# EAGLE design EBN_KL27Z4_V05 (EAGLE 7.3.0)
CNAME: EasyBoard Nano; CREVISION: 2.0; DESIGNER: Martin Olejar
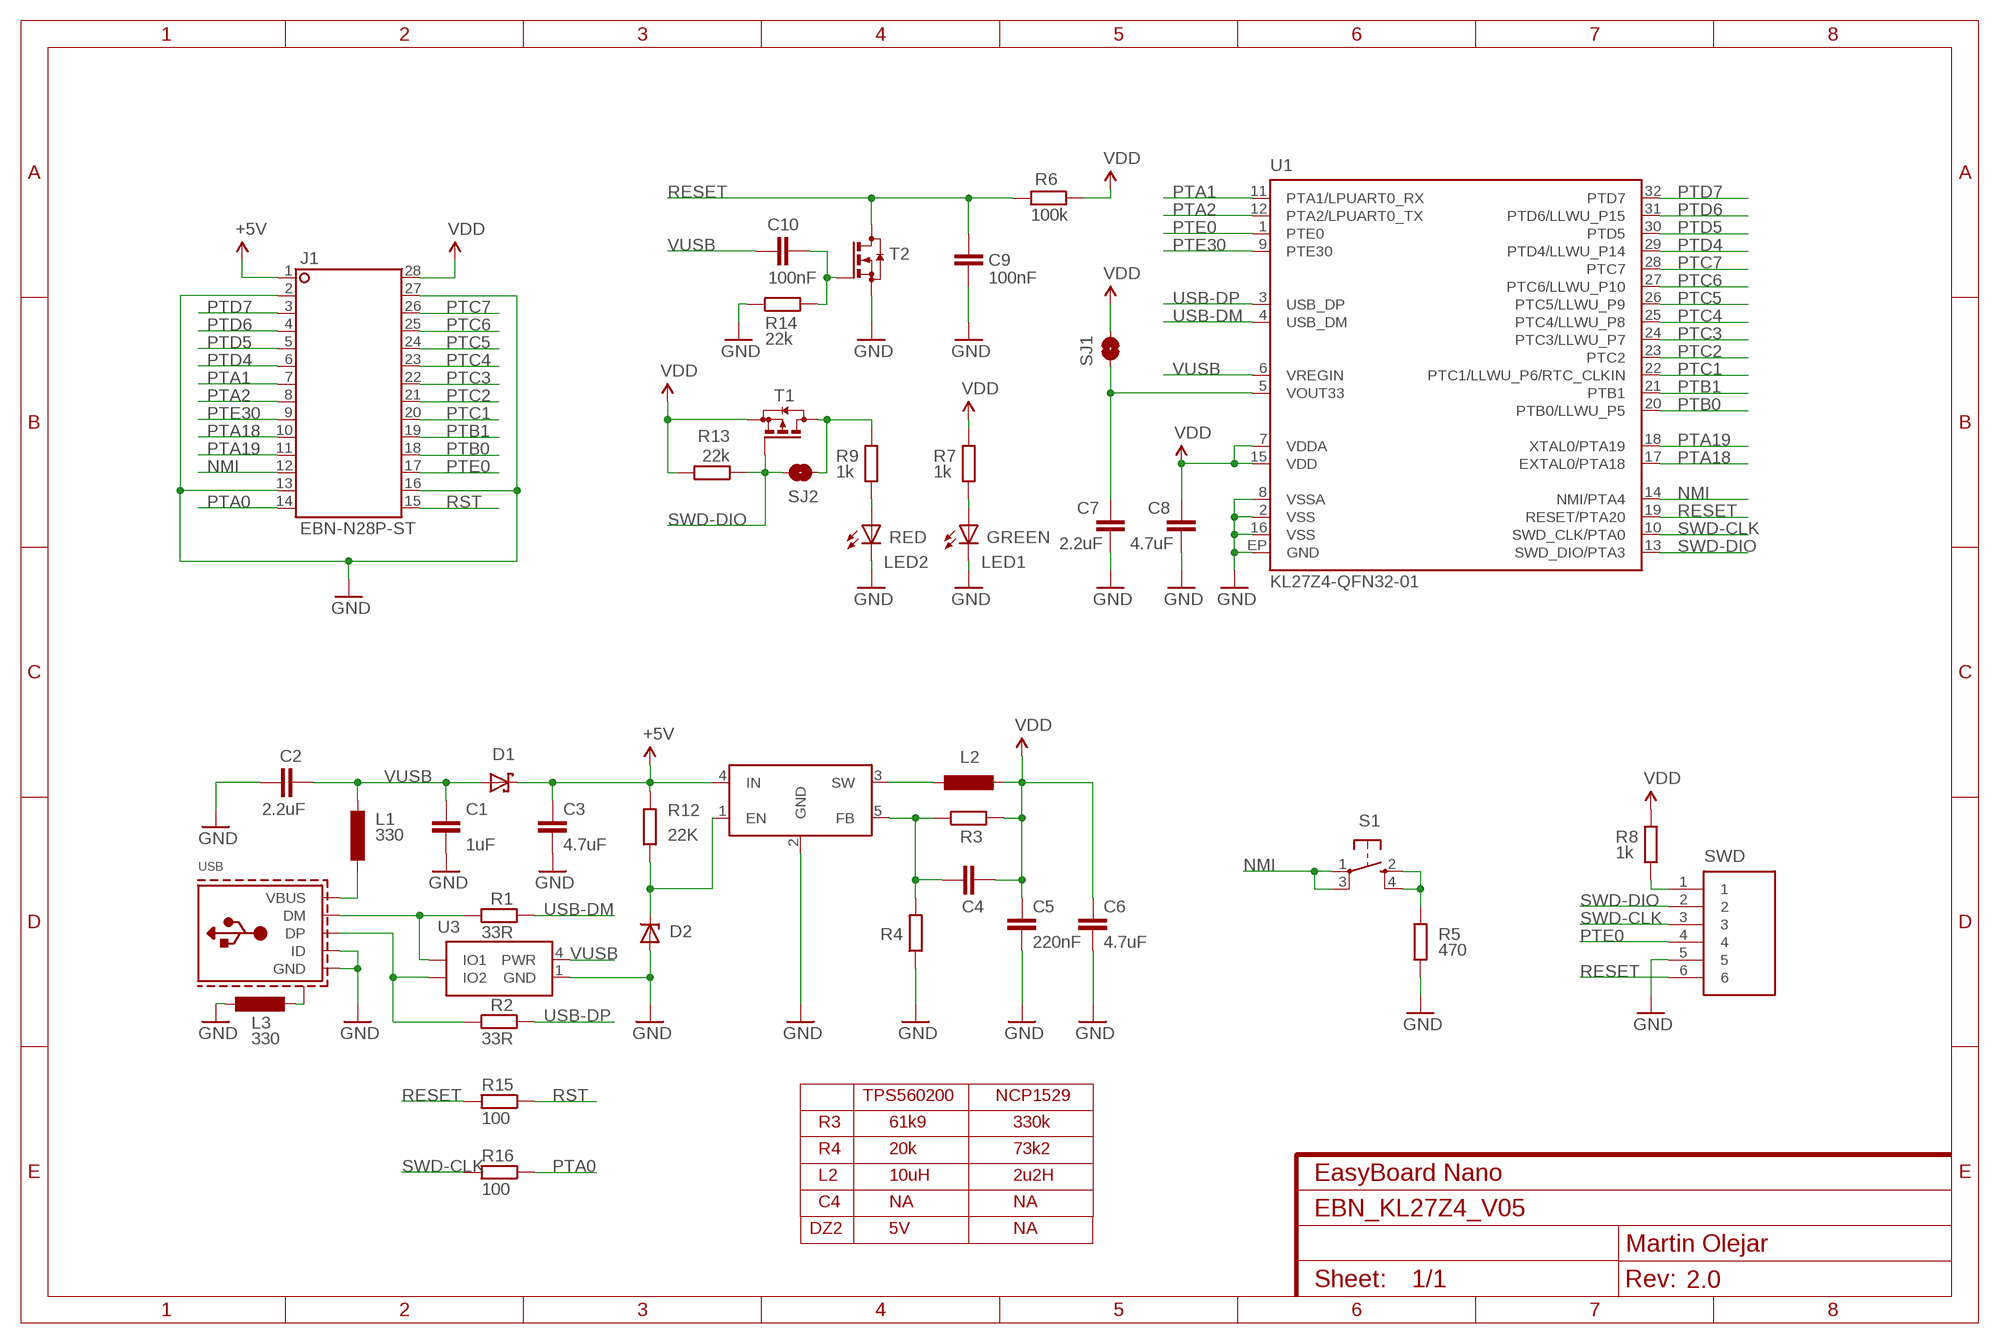
[diagram p0: schematic, sheet 1]

## Parts
C1  1uF  C-EUC0402  [C0402]
C2  2.2uF  C-EUC0603  [C0603]
C3  4.7uF  C-EUC0603  [C0603]
C4  *  C-EUC0402  [C0402]
C5  220nF  C-EUC0603  [C0603]
C6  4.7uF  C-EUC0603  [C0603]
C7  2.2uF  C-EUC0603  [C0603]
C8  4.7uF  C-EUC0603  [C0603]
C9  100nF  C-EUC0402  [C0402]
C10  100nF  C-EUC0402  [C0402]
D1  PMEG2010BER_SHOTTKY-SOD123FL  [SOD-123FL]
D2  DZ  [SOD323_ST]
J1  EBN-N28P-ST  [EBN-N28P-SHIELD]
L1  330  L-EUL0805  [L0805]
L2  2u2  L-EULPS3015  [LPS3015]
L3  330  L-EUL0805  [L0805]
LED1  LEDCHIPLED_0603  [CHIPLED_0603]
LED2  LEDCHIPLED_0603  [CHIPLED_0603]
R1  33R  R-EUR0402  [R0402]
R2  33R  R-EUR0402  [R0402]
R3  *  R-EUR0402  [R0402]
R4  *  R-EUR0402  [R0402]
R5  470  R-EUR0402  [R0402]
R6  100k  R-EUR0402  [R0402]
R7  1k  R-EUR0402  [R0402]
R8  1k  R-EUR0402  [R0402]
R9  1k  R-EUR0402  [R0402]
R12  22K  R-EUR0603  [R0603]
R13  22k  R-EUR0402  [R0402]
R14  22k  R-EUR0402  [R0402]
R15  100  R-EUR0402  [R0402]
R16  100  R-EUR0402  [R0402]
S1  SWITCH-TACT2  [KMR2]
SJ1  SJ-S  [JUMPER-SMD-S1X]
SJ2  SJ-S  [JUMPER-SMD-S1X]
SWD  CON-1X6JST-SIDE  [CON-JST1X6-SIDE]
T1  -PMOS-SOT323  [SOT323]
T2  -NMOS-SOT323  [SOT323]
U1  KL27Z4-QFN32-01  [QFN-32]
U2  MP215P  [SOT23-5L]
U3  PRTR5V0U2X  [SOT-143B]
USB  USB-5P-MICRO-SMD-05  [USB-MICRO-SMD-05]

## Nets
+5V: C3.1 D1.C J1.1 R12.2 U2.4(IN)
DM: R1.1 U3.3(IO1) USB.DM
DP: R2.1 U3.2(IO2) USB.DP
GND: C1.1 C2.2 C3.2 C5.2 C6.2 C7.2 C8.2 C9.2 D2.A J1.2 J1.13 J1.16 J1.27 L3.2 LED1.C LED2.C R4.1 R5.1 R14.1 SWD.5 T2.2(S) U1.2(VSS) U1.8(VSSA) U1.16(VSS) U1.EP(GND) U2.2(GND) U3.1(GND) USB.GND USB.ID
N$1: L1.1 USB.VBUS
N$2: L3.1 USB.SHILD@1(SHILD) USB.SHILD@2(SHILD) USB.SHILD@3(SHILD) USB.SHILD@4(SHILD)
N$3: LED1.A R7.1
N$4: D2.C R12.1 U2.1(EN)
N$5: R5.2 S1.2 S1.4
N$6: C7.1 SJ1.1 U1.5(VOUT33)
N$8: R8.1 SWD.1
N$9: LED2.A R9.1
N$10: R9.2 SJ2.1 T1.3(D)
N$12: C10.2 R14.2 T2.1(G)
N$21: L2.P$1 U2.3(SW)
N$22: C4.1 R3.1 R4.2 U2.5(FB)
NMI: J1.12 S1.1 S1.3 U1.14(NMI/PTA4)
PTA0: J1.14 R16.1
PTA1: J1.7 U1.11(PTA1/LPUART0_RX)
PTA2: J1.8 U1.12(PTA2/LPUART0_TX)
PTA18: J1.10 U1.17(EXTAL0/PTA18)
PTA19: J1.11 U1.18(XTAL0/PTA19)
PTB0: J1.18 U1.20(PTB0/LLWU_P5)
PTB1: J1.19 U1.21(PTB1)
PTC1: J1.20 U1.22(PTC1/LLWU_P6/RTC_CLKIN)
PTC2: J1.21 U1.23(PTC2)
PTC3: J1.22 U1.24(PTC3/LLWU_P7)
PTC4: J1.23 U1.25(PTC4/LLWU_P8)
PTC5: J1.24 U1.26(PTC5/LLWU_P9)
PTC6: J1.25 U1.27(PTC6/LLWU_P10)
PTC7: J1.26 U1.28(PTC7)
PTD4: J1.6 U1.29(PTD4/LLWU_P14)
PTD5: J1.5 U1.30(PTD5)
PTD6: J1.4 U1.31(PTD6/LLWU_P15)
PTD7: J1.3 U1.32(PTD7)
PTE0: J1.17 SWD.4 U1.1(PTE0)
PTE30: J1.9 U1.9(PTE30)
RESET: C9.1 R6.2 R15.2 SWD.6 T2.3(D) U1.19(RESET/PTA20)
RST: J1.15 R15.1
SWD-CLK: R16.2 SWD.3 U1.10(SWD_CLK/PTA0)
SWD-DIO: R13.1 SJ2.2 SWD.2 T1.1(G) U1.13(SWD_DIO/PTA3)
USB-DM: R1.2 U1.4(USB_DM)
USB-DP: R2.2 U1.3(USB_DP)
VDD: C4.2 C5.1 C6.1 C8.1 J1.28 L2.P$2 R3.2 R6.1 R7.2 R8.2 R13.2 SJ1.2 T1.2(S) U1.7(VDDA) U1.15(VDD)
VUSB: C1.2 C2.1 C10.1 D1.A L1.2 U1.6(VREGIN) U3.4(PWR)

## Notes on the sheet
- RED | GREEN
- TPS560200 | NCP1529
- R3 | 61k9 | 330k
- R4 | 20k | 73k2
- L2 | 10uH | 2u2H
- C4 | NA | NA
- DZ2 | 5V | NA

## Library data of the parts
C1-C10 = atomx_RLC:C-EU: CAPACITOR, European symbol
D1 = atomx_DiscreteSemi:*_SHOTTKY-
D2 = atomx_DiscreteSemi:DZ
J1 = atomx_Boards:EBN-N28P: Dual In Line
L1-L3 = atomx_RLC:L-EU: INDUCTOR, European symbol
LED1 LED2 = led:LED: LED OSRAM: - CHIPLED LG R971, LG N971, LY N971, LG Q971, LY Q971, LO R971, LY R971 LH N974, LH R974 LS Q976, LO Q976, LY Q976 LO Q996 - Hyper CHIPLED LW Q18S LB Q993, LB Q99A, LB R99A - SideLED LS A670, LO A670, LY A670, LG A670, LP A670 LB A673, LV A673, LT A673, LW A673 LH A674 LY A675 LS A676, LA A676, LO A676, LY A676, LW A676 LS A679, LY A679, LG A679 - Hyper Micro SIDELED® LS Y876, LA Y876, LO Y876, LY Y876 LT Y87S - SmartLED LW L88C, LW L88S LB L89C, LB L89S, LG L890 LS L89K, LO L89K, LY L89K LS L896, LA L896, LO L896, LY L896 - TOPLED LS T670, LO T670, LY T670, LG T670, LP T670 LSG T670, LSP T670, LSY T670, LOP T670, LYG T670 LG T671, LOG T671, LSG T671 LB T673, LV T673, LT T673, LW T673 LH T674 LS T676, LA T676, LO T676, LY T676, LB T676, LH T676, LSB T676, LW T676 LB T67C, LV T67C, LT T67C, LS T67K, LO T67K, LY T67K, LW E67C LS E67B, LA E67B, LO E67B, LY E67B, LB E67C, LV E67C, LT E67C LW T67C LS T679, LY T679, LG T679 LS T770, LO T770, LY T770, LG T770, LP T770 LB T773, LV T773, LT T773, LW T773 LH T774 LS E675, LA E675, LY E675, LS T675 LS T776, LA T776, LO T776, LY T776, LB T776 LHGB T686 LT T68C, LB T68C - Hyper Mini TOPLED® LB M676 - Mini TOPLED Santana® LG M470 LS M47K, LO M47K, LY M47K Source: http://www.osram.convergy.de LUXEON: - LUMILED® LXK2-PW12-R00, LXK2-PW12-S00, LXK2-PW14-U00, LXK2-PW14-V00 LXK2-PM12-R00, LXK2-PM12-S00, LXK2-PM14-U00 LXK2-PE12-Q00, LXK2-PE12-R00, LXK2-PE12-S00, LXK2-PE14-T00, LXK2-PE14-U00 LXK2-PB12-K00, LXK2-PB12-L00, LXK2-PB12-M00, LXK2-PB14-N00, LXK2-PB14-P00, LXK2-PB14-Q00 LXK2-PR12-L00, LXK2-PR12-M00, LXK2-PR14-Q00, LXK2-PR14-R00 LXK2-PD12-Q00, LXK2-PD12-R00, LXK2-PD12-S00 LXK2-PH12-R00, LXK2-PH12-S00 LXK2-PL12-P00, LXK2-PL12-Q00, LXK2-PL12-R00 Source: www.luxeon.com KINGBRIGHT: KA-3528ASYC Source: www.kingbright.com
R1-R9 R12-R16 = atomx_RLC:R-EU: RESISTOR, European symbol
S1 = atomx_ElecMech:SWITCH-TACT2
SJ1 SJ2 = atomx_Connectors:SJ: SMD solder JUMPER
SWD = atomx_Connectors:CON-1X6
T1 = atomx_DiscreteSemi:*-PMOS-
T2 = atomx_DiscreteSemi:*-NMOS-
U1 = atomx_IC:KL27Z4-QFN32: Freescale Kinetis-L MCU: KL27Z (Cortex-M0)
U2 = atomx_Power:MP21*5P
U3 = atomx_DiscreteSemi:PRTR5V0U2X?; APPLICATIONS: General Purpose; BIDIRECTIONAL_CHANNELS: 2; CAPACITANCE: 1pF @ 1MHz; CURRENT_PEAK_PULSE: -; DESCRIPTION: TVS DIODE 5.5VWM SOT143B; DOCUMENTATION_LINK: <a href="http://www.nxp.com/documents/data_sheet/PRTR5V0U2X.pdf">Datasheet</a>; DOCUMENTATION_URL: http://www.nxp.com/documents/data_sheet/PRTR5V0U2X.pdf; MANUFACTURER: NXP Semiconductors; MOUNTING_TYPE: Surface Mount; OPERATING_TEMPERATURE: -40C ~ 85C; PART_NUMBER: PRTR5V0U2X,215; POWER-PEAK_PULSE: -; POWER_LINE_PROTECTION: Yes; SUPPLIER_ITEM_LINK: <a href="http://www.digikey.com/product-detail/en/PRTR5V0U2X,215/568-4140-1-ND/1589981">Details</a>; SUPPLIER_ITEM_NUMBER: 568-4140-1-ND; SUPPLIER_ITEM_URL: http://www.digikey.com/product-detail/en/PRTR5V0U2X,215/568-4140-1-ND/1589981; SUPPLIER_LINK: <a href="http://www.digikey.com">Home Page</a>; SUPPLIER_NAME: Digi-Key; SUPPLIER_URL: http://www.digikey.com; TYPE: Steering (Rail to Rail); UNIDIRECTIONAL_CHANNELS: -; VOLTAGE_BREAKDOWN: 6V; VOLTAGE_CLAMPING: -; VOLTAGE_REVERSE: 5.5V
USB = atomx_Connectors:USB-5P: USB Connectors

## Board
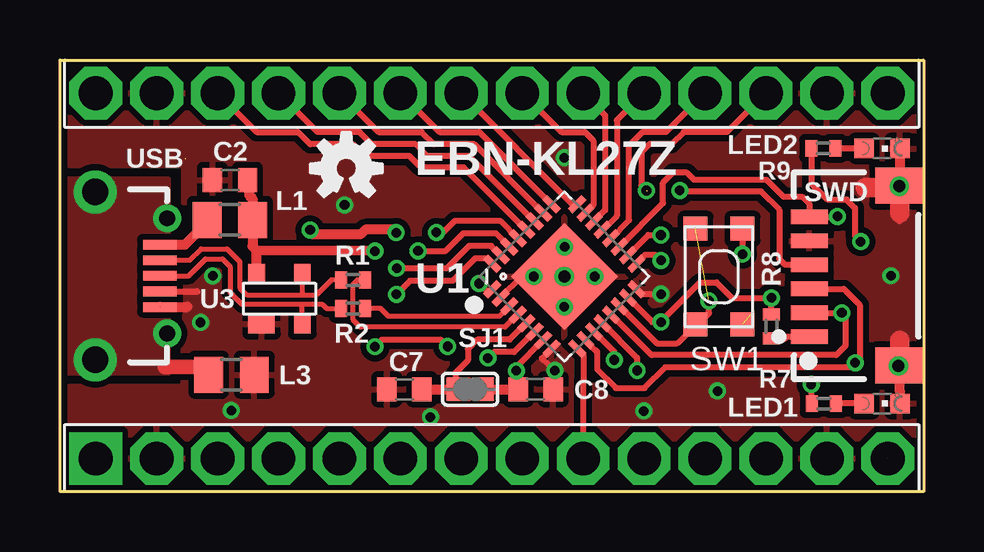
[diagram p1: board, top side]
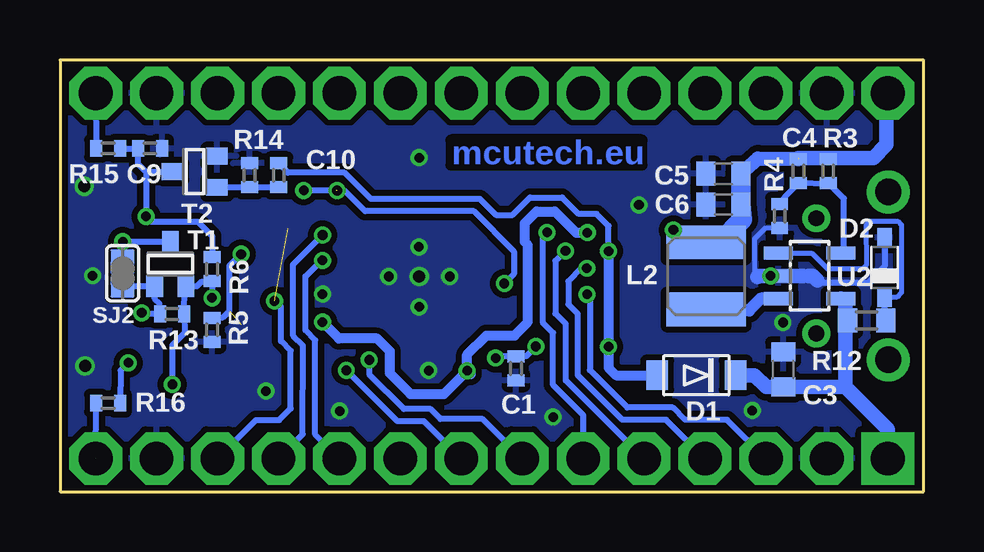
[diagram p2: board, bottom side, seen from below]

Size 36 x 18 mm. Coordinates in mm from the lower left corner, seen from the top.
Outline: 0,0 0,18 36,18 36,0 0,0
Copper layers (1*16): Top 0.035mm / dielectric 1.5mm / Bottom 0.035mm
Design rules "ITEADstudio_DRC *": minimum track width 6mil, minimum drill 12mil, track to track 10mil, track to pad 10mil, pad to pad 10mil, via to via 10mil, smd to smd 10mil, copper to edge 10mil, drill to drill 10mil, minimum pad ring 10mil, minimum via ring 6mil, stop-mask expansion 2mil, vias tented up to drill 100mil, thermal gap 10mil

### Footprints (pad centres in the part's own frame; a part is rotated, then mirrored left to right if it is on the bottom)
C0402 = smd 0.5 x 0.7: 1 -0.5,0; 2 0.5,0
C0603 = smd 0.8 x 1: 1 -0.73,0; 2 0.73,0
SOD-123FL = smd 0.91 x 1.22: A 1.637,0; C -1.637,0
SOD323_ST = smd 0.8 x 0.6: A 1.25,0; C -1.25,0
EBN-N28P-SHIELD = drill 1.4 pad 2.2 square: 1 -16.51,-7.62 | drill 1.4 pad 2.2 octagon: 2 -13.97,-7.62; 3 -11.43,-7.62; 4 -8.89,-7.62; 5 -6.35,-7.62; 6 -3.81,-7.62; 7 -1.27,-7.62; 8 1.27,-7.62; 9 3.81,-7.62; 10 6.35,-7.62; 11 8.89,-7.62; 12 11.43,-7.62; 13 13.97,-7.62; 14 16.51,-7.62; 15 16.51,7.62; 16 13.97,7.62; 17 11.43,7.62; 18 8.89,7.62; 19 6.35,7.62; 20 3.81,7.62; 21 1.27,7.62; 22 -1.27,7.62; 23 -3.81,7.62; 24 -6.35,7.62; 25 -8.89,7.62; 26 -11.43,7.62; 27 -13.97,7.62; 28 -16.51,7.62
L0805 = smd 1.2 x 1.5: 1 -0.95,0; 2 0.95,0
LPS3015 = smd 1.4 x 3.3: P$1 -1.4,0; P$2 1.4,0
CHIPLED_0603 = smd 0.8 x 0.8: A 0,-0.75; C 0,0.75
R0402 = smd 0.5 x 0.7: 1 -0.5,0; 2 0.5,0
R0603 = smd 0.8 x 1: 1 -0.8,0; 2 0.8,0
KMR2 = smd 1 x 1: 1 2,0.98; 2 2,-0.98; 3 -2,0.98; 4 -2,-0.98
JUMPER-SMD-S1X = smd 0.6 x 1: 1 -0.7,0; 2 0.7,0
CON-JST1X6-SIDE = smd 0.6 x 1.55: 1 -2.54,2.032; 2 -1.54,2.032; 3 -0.54,2.032; 4 0.46,2.032; 5 1.46,2.032; 6 2.46,2.032 | smd 1.5 x 2: P$1 -3.74,-1.72; P$2 3.76,-1.72
SOT323 = smd 0.7 x 0.9: 1 -0.65,-0.925; 2 0.65,-0.925; 3 0,0.925
QFN-32 = smd 0.8 x 0.285: 1 -2.5,1.75; 2 -2.5,1.25; 3 -2.5,0.75; 4 -2.5,0.25; 5 -2.5,-0.25; 6 -2.5,-0.75; 7 -2.5,-1.25; 8 -2.5,-1.75; 17 2.5,-1.75; 18 2.5,-1.25; 19 2.5,-0.75; 20 2.5,-0.25; 21 2.5,0.25; 22 2.5,0.75; 23 2.5,1.25; 24 2.5,1.75 | smd 0.285 x 0.8: 9 -1.75,-2.5; 10 -1.25,-2.5; 11 -0.75,-2.5; 12 -0.25,-2.5; 13 0.25,-2.5; 14 0.75,-2.5; 15 1.25,-2.5; 16 1.75,-2.5; 25 1.75,2.5; 26 1.25,2.5; 27 0.75,2.5; 28 0.25,2.5; 29 -0.25,2.5; 30 -0.75,2.5; 31 -1.25,2.5; 32 -1.75,2.5 | smd 3.15 x 3.15: EP 0,0
SOT23-5L = smd 0.55 x 1.2: 1 -0.95,-1.3; 2 0,-1.3; 3 0.95,-1.3; 4 0.95,1.3; 5 -0.95,1.3
SOT-143B = smd 1.1 x 0.8: 1 -0.75,-1.05 | smd 0.7 x 0.8: 2 0.95,-1.05; 3 0.95,1.05; 4 -0.95,1.05
USB-MICRO-SMD-05 = smd 1.4 x 0.4: DM 2.7,0.65; DP 2.7,0; GND 2.7,-1.3; ID 2.7,-0.65; VBUS 2.7,1.3 | drill 1.1 pad 1.8: SHILD@1 0,-3.5; SHILD@2 0,3.5 | drill 0.65 pad 1.1: SHILD@3 3,-2.4; SHILD@4 3,2.4

### Placement (x,y rotation side)
C1  16.99,5.14 90 bottom
C2  7.09,12.99 180 top
C3  5.84,5.1 90 bottom
C4  5.22,13.36 90 bottom
C5  8.35,11.98 180 bottom
C6  8.35,13.25 180 bottom
C7  14.36,4.27 180 top
C8  19.83,4.27 0 top
C9  32.25,14.31 0 bottom
C10  26.88,13.19 270 bottom
D1  9.47,4.85 180 bottom
D2  1.62,9.35 90 bottom
J1  18,9 0 top
L1  7.09,11.33 0 top
L2  9.06,8.99 90 bottom
L3  7.15,4.87 0 top
LED1  34.27,3.67 270 top
LED2  34.27,14.31 270 top
R1  12.22,8.82 0 top
R2  12.21,7.64 0 top
R3  3.97,13.37 90 bottom
R4  6,11.49 90 bottom
R5  29.66,6.75 90 bottom
R6  29.66,9.27 90 bottom
R7  31.84,3.67 180 top
R8  29.66,6.89 90 top
R9  31.82,14.31 180 top
R12  2.37,7.13 180 bottom
R13  31.33,7.41 0 bottom
R14  28.09,13.19 270 bottom
R15  33.99,14.31 0 bottom
R16  33.99,3.69 0 bottom
S1  27.47,8.96 90 top
SJ1  17.1,4.27 0 top
SJ2  33.39,9.1 270 bottom
SWD  33.27,9 90 top
T1  31.4,9.49 0 bottom
T2  30.38,13.34 90 bottom
U1  21.02,8.97 45 top
U2  4.75,9 270 bottom
U3  9.15,8.04 0 top
U$2  [OSHW-LOGO-S]  11.93,13.48 0 top
USB  1.47,9 0 top

### Tracks (layer width: path | path; a pad name or v marks a point on that pad's centre or on a via)
+5V
  Bottom 0.254: R12.2 3.21,6.9 3.26,6.95
  Bottom 0.61: 5.77,4.36 C3.1 | U2.4 3.26,8 3.26,6.95 3.26,4.37 | C3.1 3.26,4.37 | D1.C 7.05,4.85 6.56,4.36 5.86,4.36 C3.1 | J1.1 1.49,2.6 3.26,4.37
DM
  Top 0.2: 4.33,9.66 5.42,9.66 5.88,10.12 6.96,10.12 7.49,9.59 7.49,8.5 7.79,8.2 10.1,8.2 | R1.1 11.31,8.82 10.69,8.2 10.1,8.2 | U3.3 10.1,8.2
  Top 0.254: USB.DM 4.33,9.66
DP
  Top 0.2: USB.DP 5.37,9 6.07,9.7 6.78,9.7 7.09,9.39 7.09,8.31 7.6,7.8 10.09,7.8 | 10.13,6.96 U3.2 10.1,7.79 10.09,7.8 | 10.09,7.8 10.95,7.8 11.12,7.63 11.69,7.63 R2.1
GND  (via drill 0.4, 0.5)  (1 unrouted)
  Top 0.254: U1.2 19.26,8.97 19.5,8.97 | 20.52,5.99 U1.8 20.08,5.56 v20.63,5.05 20.54,4.4 20.71,4.18 | 35.01,11.62 35.01,11.26 34.89,12.68 | 34.89,5.31 34.89,5.06 35.01,6.31 | 23.83,8.63 24.23,8.23 v25.05,8.23 | 5.72,8.35 5.72,8.34 4.32,8.34 USB.ID | LED1.C 35.02,4.17 | v34.99,12.73 35.04,12.78
  Top 0.406: 19.5,8.97 v19.75,8.97 | USB.GND 5.32,7.7 | 35.02,4.17 35.02,4.95 | 35.04,12.78 35.04,14.32
  Top 0.61: 35.02,5.18 35.01,6.31
  Top 0.813: 35.01,13.1 35.01,11.62 | 35.01,6.31 35.02,4.95 | 33.58,12.68 34.89,12.68
  Bottom 0.2: 7.05,8.94 7.05,10.54 6.62,10.97 R4.1
  Bottom 0.254: D2.A 1.62,9.4 2.32,8.7 4.32,8.7 4.42,8.8
  Bottom 0.61: 4.82,9 4.62,9 4.42,8.8 | 6.92,8.95 6.87,9 5.02,9
  other vias: 21.02,8.97 21.03,10.2 21.02,7.7 22.29,8.97 7.14,3.38 34.96,5.24 6.37,8.99 5.86,7.05 11.87,11.95 24.34,3.36 15.44,3.11 21.03,13.92 34.64,9 27.41,4.19
  pour Bottom: 0.4,17.82 35.74,17.82 35.74,0.17 0.4,0.17
  pour Top: 0.42,17.85 35.72,17.85 35.72,0.15 0.42,0.15 0.4,4.38 5.15,4.38 5.17,13.6 0.42,13.6
N$1
  Top 0.254: L1.1 6.13,11.21 5.97,11.05
  Top 0.406: 6.34,11.08 L1.1 | USB.VBUS 5.22,10.3 5.97,11.05
N$2
  Top 0.61: L3.1 5.77,5.2 4.37,5.2
  pour Top (no thermals): 0.37,13.03 4.49,13.03 4.49,4.95 0.37,4.95
N$3
  Top 0.254: LED1.A R7.1
N$4
  Bottom 0.2: U2.1 4.67,9.95 4.02,9.3 2.52,9.3 2.37,9.45 2.38,11.13 2.23,11.28 1.08,11.28 0.92,11.12 0.92,8.3 1.12,8.1 D2.C
  Bottom 0.254: R12.1 1.62,7.15 D2.C
N$5  (via drill 0.4)  (1 unrouted)
  Top 0.254: S1.2 v28.45,9.9
  Bottom 0.254: R5.2 29.2,7.27 28.93,7.54 28.93,9.42 v28.45,9.9
N$6
  Top 0.254: U1.5 18.75,6.34 17.41,6.34 17.01,5.93 17.01,5.47 16.49,4.95 16.49,4.22 SJ1.1 | SJ1.1 16.49,4.13 | 16.48,4.27 SJ1.1
  Top 0.406: C7.1 16.48,4.27
N$8
  Top 0.254: R8.1 30.21,6.37 30.3,6.46 SWD.1
N$9
  Top 0.254: LED2.A R9.1
N$10  (via drill 0.4)
  Top 0.254: R9.2 31.32,12.85 31.99,12.18 32.79,12.18 33.14,11.83 33.14,10.66 v33.38,10.42
  Bottom 0.254: T1.3 31.41,10.43 v33.37,10.43 v33.38,10.42 33.38,10.02 SJ2.1
N$12
  Bottom 0.254: T2.1 R14.2 C10.2
N$21
  Bottom 0.406: 8.62,7.55 L2.P$1
  Bottom 0.5: U2.3 6.78,8.05 7.28,7.55 8.62,7.55
N$22
  Bottom 0.254: U2.5 3.32,9.96 3.32,12.22 R3.1 4,12.82 C4.1 | 5.18,12.87 C4.1 | 5.93,12.02 R4.2 6,12.05 C4.1
NMI  (via drill 0.4)  (1 unrouted)
  Top 0.254: U1.14 24.88,6.18 25.73,6.18 26.49,6.94 S1.3 26.59,6.96 27.06,7.43 v27.06,7.95
  Bottom 0.254: J1.12 27.83,2.98 26.86,2.98 26.38,3.46 26.38,5.87 26.79,6.28 26.79,7.71 v27.06,7.95
PTA0  (1 unrouted)
  Bottom 0.254: J1.14 R16.1
PTA1  (via drill 0.4)
  Top 0.254: U1.11 23.11,5.82 v23.11,5.49
  Bottom 0.254: v23.11,5.49 23.11,4.89 21.66,3.44 20.55,3.44 20.14,3.03 18.39,3.03 J1.7
PTA2  (via drill 0.4)
  Top 0.254: U1.12 24.06,5.58 v24.06,5.05
  Bottom 0.254: J1.8 20.83,2.93 21.93,2.93 v24.06,5.05
PTA18  (via drill 0.4)
  Top 0.254: U1.17 24.2,9.68 24.4,9.88 24.82,9.88 v25.06,9.64
  Bottom 0.254: J1.10 25.36,2.38 25.36,6.31 25.77,6.72 25.77,8.97 25.1,9.64 v25.06,9.64
PTA19  (via drill 0.4)
  Top 0.254: U1.18 24.52,10.7 v25.05,10.7
  Bottom 0.254: J1.11 25.88,2.39 25.87,6.09 26.28,6.5 26.29,9.46 v25.05,10.7
PTB0
  Top 0.254: U1.20 23.72,11.31 23.72,14.43 24.29,14.99 25.27,14.99 J1.18
PTB1
  Top 0.254: U1.21 22.5,10.77 23.22,11.49 23.22,15.48 J1.19
PTC1
  Top 0.254: U1.22 22.12,11.13 22.72,11.73 22.72,15.7 J1.20
PTC2
  Top 0.254: U1.23 22.23,11.95 22.23,14.64 21.88,14.99 20.9,14.99 J1.21
PTC3
  Top 0.254: J1.22 21.41,11.93 U1.24
PTC4
  Top 0.254: J1.23 15.82,14.99 17.48,14.99 U1.25
PTC5
  Top 0.254: J1.24 13.28,14.99 15.08,14.99 15.59,14.48 17.28,14.48 U1.26
PTC6
  Top 0.254: J1.25 10.74,14.99 12.49,14.99 13,14.48 14.83,14.48 15.31,14 17.06,14 U1.27
PTC7
  Top 0.254: J1.26 8.2,14.99 9.92,14.99 10.43,14.48 12.21,14.48 12.69,14 14.57,14 15.05,13.52 16.83,13.52 U1.28
PTD4  (via drill 0.4)
  Top 0.254: U1.29 18.37,11.28 16.45,11.28 15.97,10.8 v15.7,10.8
  Bottom 0.254: J1.6 14.19,3.19 15.44,4.44 15.44,6.62 15.88,7.06 15.88,10.66 v15.7,10.8
PTD5  (via drill 0.4)
  Top 0.254: U1.30 18.17,10.77 16.81,10.77 16.07,10.04 v14.93,10.04
  Bottom 0.254: v14.93,10.04 15.35,9.62 15.35,7.42 14.91,6.99 14.91,4.63 J1.5
PTD6  (via drill 0.4)
  Top 0.254: U1.31 17.98,10.25 17.06,10.25 16.13,9.31 v14.04,9.31
  Bottom 0.254: J1.4 10.74,3 12.56,3 14.41,4.85 14.41,7.41 14.81,7.81 14.81,8.77 14.27,9.31 v14.04,9.31
PTD7  (via drill 0.4)
  Top 0.254: U1.32 17.78,9.73 17.32,9.73 16.37,8.79 14.59,8.79 v14.03,8.22
  Bottom 0.254: J1.3 8.2,3 9.94,3 10.45,3.51 12.35,3.51 13.91,5.07 13.91,8.11 v14.03,8.22
PTE0  (via drill 0.4)  (1 unrouted)
  Top 0.254: J1.17 27.81,14.99 26,14.99 25.5,14.48 24.56,14.48 24.23,14.15 24.23,12.77 v24.45,12.55 | U1.1 17.87,8.29 v17.47,8.68 | SWD.4 30.22,9.46 29.98,9.7 29.98,11.76 29.22,12.52 25.88,12.52 v25.84,12.56
  Bottom 0.254: v17.47,8.68 17.08,9.07 17.08,10.02 18.75,11.69 23.28,11.69 24.14,12.55 v24.45,12.55 | 24.48,12.56 v25.84,12.56
PTE30
  Top 0.254: U1.9 21.81,5.71 21.81,4.62 21.81,4.63 J1.9
RESET  (via drill 0.4)
  Top 0.254: SWD.6 32.41,11.46 v32.41,11.47 | SWD.6 | SWD.6 | SWD.6 31.23,12.01 30.94,12.3 30.16,12.3 29.45,13.01 26.43,13.01 26.14,13.3 25.56,13.3 25.14,12.88 25.14,12.03 U1.19
  Bottom 0.254: 32.43,11.47 v32.41,11.47 | 32.41,11.45 v32.41,11.47 | 32.41,11.5 v32.41,11.47 | v32.41,11.47 32.41,11.46 32.19,11.24 30.24,11.24 29.66,10.66 R6.2 | R15.2 C9.1 32.75,13.66 32.41,13.32 | T2.3 31.33,13.32 32.41,13.32 | 32.41,13.32 v32.41,11.47
RST
  Bottom 0.254: J1.15 R15.1
SWD-CLK  (via drill 0.4)
  Top 0.254: U1.10 22.33,5.89 22.34,5.88 22.39,5.83 22.39,5.1 23.17,4.32 24.37,4.32 25.23,5.18 32.96,5.18 v33.15,5.37 33.34,5.56 33.34,7.79 32.67,8.46 SWD.3 | 31.25,8.44 SWD.3 | SWD.3
  Bottom 0.254: R16.2 33.47,5.05 v33.15,5.37
SWD-DIO  (via drill 0.4)
  Top 0.254: 31.25,7.45 SWD.2 32.36,7.46 v32.59,7.46 | 32.62,7.45 v32.59,7.46 | U1.13 24.66,5.69 32.36,5.69 32.76,6.09 32.76,7.29 v32.59,7.46
  Bottom 0.254: v32.59,7.46 32.55,7.41 R13.1 31.85,7.84 32.05,8.04 T1.1 | 32.01,8.53 T1.1 | SJ2.2 32.99,8.56 T1.1
USB-DM
  Top 0.2: U1.4 18.56,6.86 12.52,6.86 12.22,7.16 12.22,8.64 12.4,8.82 R1.2
USB-DP
  Top 0.2: U1.3 18.3,7.31 13.69,7.31 13.36,7.64 12.74,7.64 R2.2
VDD  (via drill 0.4)  (1 unrouted)
  Top 0.2: v25.05,7.07 25.05,7.09 | v29.66,8.08
  Top 0.254: R7.2 v31.32,4.47 | U1.7 19.02,5.2 v19.02,5.04 | U1.15 24.7,7.07 v25.05,7.07 | R8.2 29.66,7.41 v29.66,8.08 | 25.05,7.09 26.68,8.72 27.37,8.72 28.01,8.08 v29.66,8.08
  Top 0.305: C8.1 19.02,4.27
  Top 0.406: SJ1.2 C8.1 | 19.02,4.27 v19.02,5.04 | v14.02,10.8 13.89,10.92 12.73,10.92 12.53,10.72 10.55,10.72 v10.43,10.91
  Bottom 0.2: 10.15,10.77 10.34,10.77 v10.43,10.91
  Bottom 0.254: L2.P$2 8.88,10.36 8.87,10.35 8.02,10.35 7.96,10.41 | 30.81,7.41 R13.2 | R13.2 30.81,8.51 T1.2 30.29,8.56 30.09,8.76 29.58,8.76 R6.1 29.66,8.75 v29.66,8.08 | R13.2 30.81,6.61 31.32,6.1 v31.32,4.47 | R3.2 3.97,13.91
  Bottom 0.406: v19.02,5.04 18.86,4.91 | v19.02,5.04 19.02,5.71 18.23,6.51 17.05,6.51 16.49,7.08 16.49,10.28 16.62,10.41 16.62,11.19 16.13,11.68 15.37,11.68 14.49,10.8 v14.02,10.8 | L2.P$2 9.62,10.24 10.15,10.77 | v19.02,5.04 19.99,4.07 21.39,4.07 22.26,4.94 22.26,5.86 22.78,6.38 24.37,6.38 v25.05,7.07
  Bottom 0.6: 3.31,13.91 3.97,13.91 5.22,13.91
  Bottom 0.61: J1.28 1.54,15.68 1.54,15.34 1.55,15.33 1.55,14.46 2.1,13.91 3.31,13.91 | C6.1 6.91,13.89 C4.2
  Bottom 0.813: 7.96,10.41 7.96,10.94 7.55,11.35 C5.1 C6.1
VUSB  (via drill 0.4)
  Top 0.254: U1.6 18.94,5.82 18.09,5.82 v17.84,5.57 | v16.16,6.05 15.88,6.33 13.42,6.33 v13.13,6.04
  Top 0.4: 8.2,10.06 13.1,10.06
  Top 0.406: 8.01,11.36 L1.2 | 8.22,11.25 L1.2 | 8.05,11.32 L1.2 | L1.2 8.03,10.23 8.2,10.06 U3.4 | C2.1 7.89,12.35 8.03,12.21 L1.2 | 13.1,10.06 v13.13,10.03
  Bottom 0.254: v16.16,6.05 16.57,5.64 C1.2 17.77,5.64 v17.84,5.57 | 13.13,5.16 13.13,5.79 v13.13,6.04 | v13.13,10.03 13.13,11.08 13.63,11.58 14.38,11.58 15.07,12.27 16.4,12.27 17.13,11.54 17.83,11.54 18.49,12.2 23.04,12.2 24.14,13.3 26.49,13.3 C10.1
  Bottom 0.406: v13.13,10.03 13.13,5.16 12.82,4.85 D1.A

### Text on the board
Bottom: mcutech.eu
tPlace: EBN-KL27Z | SW1